# Altium schematic sheet Relays.SchDoc
size A4; SheetNumber: 2; SheetTotal: 2
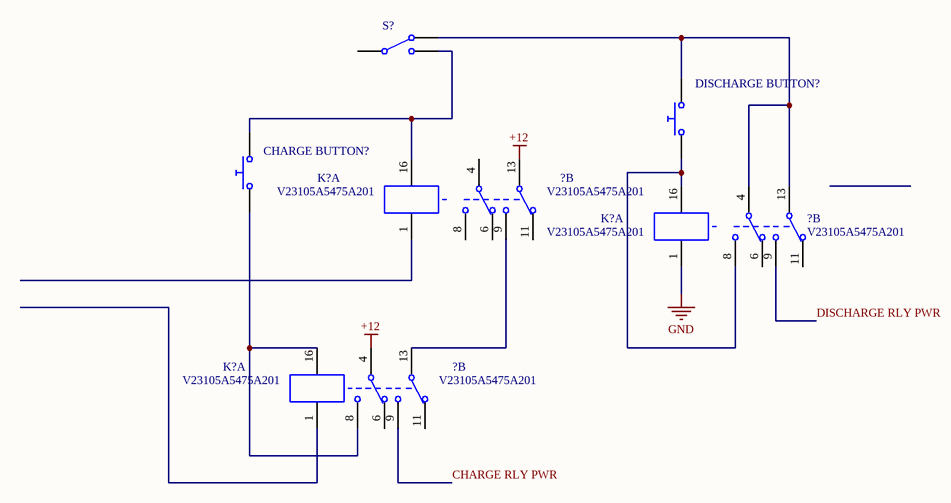
[diagram p0: Relays.SchDoc]

## Parts
(Parts that share a designator on the sheet are numbered #1, #2 ... from top to bottom, then left to right.)
?#1  V23105A5475A201  [TI 2-DIL]  (part B of 2)
?#2  V23105A5475A201  [TI 2-DIL]  (part B of 2)
?#3  V23105A5475A201  [TI 2-DIL]  (part B of 2)
CHARGE_BUTTON?  Push Button Normally Opened  (value not drawn)
DISCHARGE_BUTTON?  Push Button Normally Opened  (value not drawn)
K?#1  V23105A5475A201  [TI 2-DIL]  (part A of 2)
K?#2  V23105A5475A201  [TI 2-DIL]  (part A of 2)
K?#3  V23105A5475A201  [TI 2-DIL]  (part A of 2)
S?  Single-Pole, Double-Throw Switch  (value not drawn)

## Nets
+12: ?#1.13 ?#3.4
GND: K?#2.1
CHARGE RLY PWR: ?#3.9
DISCHARGE RLY PWR: ?#2.9
Net?#1_9: ?#1.9 ?#3.13
Net?#2_4: ?#2.4 ?#2.13 DISCHARGE_BUTTON?.2 S?.3
Net?#2_8: ?#2.8 DISCHARGE_BUTTON?.1 K?#2.16
Net?#3_8: ?#3.8 CHARGE_BUTTON?.1 K?#3.16
NetCHARGE_BUTTON?_2: CHARGE_BUTTON?.2 K?#1.16 S?.2

Not connected (* = marked no-connect by the designer): ?#1 4 6 8 11; ?#2 6 11; ?#3 6 11; K?#1 1; K?#3 1; S? 1

## Library data of the parts
?#1-?#3 K?#1-K?#3 = V23105A5475A201: 5V DPDT Relay 3A 220VDC; Manufacturer: Axicom; Part Number: V23105A5475A201; Digikey Part Number: PB383-ND; Digikey Link: https://www.digikey.com/products/en?mpart=V23105A5001A201&v=41
CHARGE_BUTTON? DISCHARGE_BUTTON? = Push Button NO: closed: 0; Rclosed: 1m; Ropen: 1Meg; SimulationGenericComponent: True
S? = SPDT SW: nodeUP_closed: 1; Rclosed: 1m; Ropen: 1Meg; SimulationGenericComponent: True